# Altium schematic sheet Booster.SchDoc
size A4
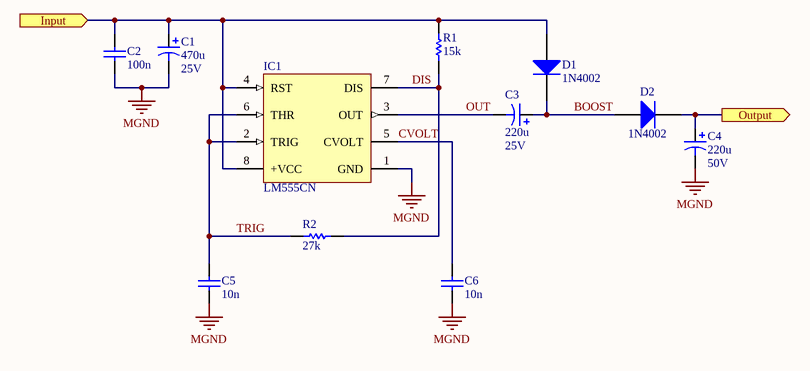
[diagram p0: Booster.SchDoc]

## Parts
C1  470u  Voltage: 25V  [CAP-5-ELCO-10x12.5]
C2  100n  [CAP-0.2-CERA]
C3  220u  Voltage: 25V  [CAP-5-ELCO-10x16]
C4  220u  Voltage: 50V  [CAP-5-ELCO-10x16]
C5  10n  [CAP-0.1-CERA2]
C6  10n  [CAP-0.1-CERA2]
D1  1N4002  [DIODE-0.3-SI]
D2  1N4002  [DIODE-0.3-SI]
IC1  LM555CN  [IC-DIP-8]
R1  15k  [RES-0.4]
R2  27k  [RES-0.4]

## Ports
Input (in), Output (out)

## Nets
MGND: C1.2 C2.1 C4.2 C5.1 C6.1 IC1.1(GND)
BOOST: C3.1 D1.2(K) D2.1(A)
CVOLT: C6.2 IC1.5(CVOLT)
DIS: IC1.7(DIS) R1.2 R2.2
Input: C1.1 C2.2 D1.1(A) IC1.4(RST) IC1.8(+VCC) R1.1 ; port Input
OUT: C3.2 IC1.3(OUT)
Output: C4.1 D2.2(K) ; port Output
TRIG: C5.2 IC1.2(TRIG) IC1.6(THR) R2.1

## Library data of the parts
C1 C3 C4 = Cap Pol3: Polarized Capacitor (Surface Mount); Published: 8-Jun-2000; LatestRevisionDate: 29-May-2009; LatestRevisionNote: IPC-7351 Footprint Added.; PackageReference: C0805; Publisher: Altium Limited; PackageDescription: Chip Capacitor
  C1: Value: 470u
  C3 C4: Value: 220u
C2 C5 C6 = Cap: Capacitor; Published: 8-Jun-2000; LatestRevisionDate: 17-Jul-2002; LatestRevisionNote: Re-released for DXP Platform.; PackageReference: RAD-0.3; Publisher: Altium Limited; PackageDescription: Radial Cap, Thru-Hole; 2 Leads; 0.3 in Pin Spacing
  C2: Value: 100n
  C5 C6: Value: 10n
D1 D2 = Diode 1N4002: 1 Amp General Purpose Rectifier; Published: 8-Jun-2000; LatestRevisionDate: 17-Jul-2002; LatestRevisionNote: Re-released for DXP Platform.; DatasheetVersion: 1998; PackageVersion: Aug-1999; PackageReference: DO-41; Publisher: Altium Limited; PackageDescription: Diode, Axial; Body 5.2 x 2.7 mm (LxDia. max), Lead Dia. 0.86 mm (max); Code_JEDEC: DO-204-AL; ComponentLink1Description: Manufacturer Link; ComponentLink1URL: http://www.fairchildsemi.com/; ComponentLink2Description: Datasheet; ComponentLink2URL: http://www.fairchildsemi.com/ds/1N%2F1N4001.pdf
IC1 = LM555CN: Timer; Manufacturer: National Semiconductor; CompType: Analog IC; PackageTopMarking: NSUZXYTT*LM*555CN; PowerWise: N; Published: 4-Dec-2008; DatasheetVersion: Jul-2006; PackageVersion: revG, May-2006; PackageReference: N08E; Publisher: Altium Limited; PackageDescription: MDIP, .365 x .250 x .130in, 8 Lead, .100in Pitch; PartNumber: LM555CN; PinCount: 8; DigiKeyPartNumber: LM555CNNS-ND; Code_JEDEC: MS-001-BA; ComponentLink1Description: LM555 Datasheet; ComponentLink1URL: http://www.national.com/ds.cgi/LM/LM555.pdf; ComponentLink2Description: LM555 Web Page; ComponentLink2URL: http://www.national.com/pf/LM/LM555.html; ComponentLink3Description: N08E package page; ComponentLink3URL: http://www.national.com/packaging/folders/n08e.html
R1 R2 = Res1: Resistor; Published: 8-Jun-2000; LatestRevisionDate: 17-Jul-2002; LatestRevisionNote: Re-released for DXP Platform.; PackageReference: AXIAL-0.3; Publisher: Altium Limited; PackageDescription: Axial Device, Thru-Hole; 2 Leads; 0.3 in Pin Spacing
  R1: Value: 15k
  R2: Value: 27k